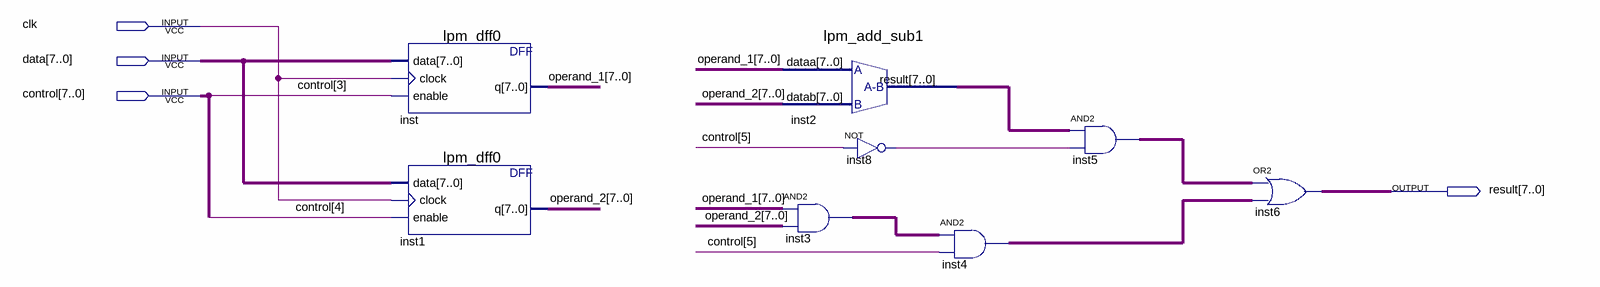
[diagram p0: schematic sheet]
// Quartus schematic ALU.bdf as structural Verilog: 8 symbols, 4 pins
module ALU (
  input  clk,
  input  [7:0] data,
  input  [7:0] control,
  output [7:0] result
);

  wire inst8_out;
  wire [7:0] inst2_result, inst3_out, inst4_out, inst5_out, operand_1, operand_2;

  lpm_dff0 inst (.data(data), .clock(clk), .enable(control[3]), .q(operand_1));
  lpm_dff0 inst1 (.data(data), .clock(clk), .enable(control[4]), .q(operand_2));
  lpm_add_sub1 inst2 (.dataa(operand_1), .datab(operand_2), .result(inst2_result));
  assign inst3_out = operand_1 & operand_2;  // AND2 inst3, 8 bits wide
  not inst8 (inst8_out, control[5]);
  assign inst4_out = inst3_out & {8{control[5]}};  // AND2 inst4, 8 bits wide
  assign inst5_out = inst2_result & {8{inst8_out}};  // AND2 inst5, 8 bits wide
  assign result = inst5_out | inst4_out;  // OR2 inst6, 8 bits wide
endmodule
